# Altium schematic sheet I2C.SchDoc
size A4
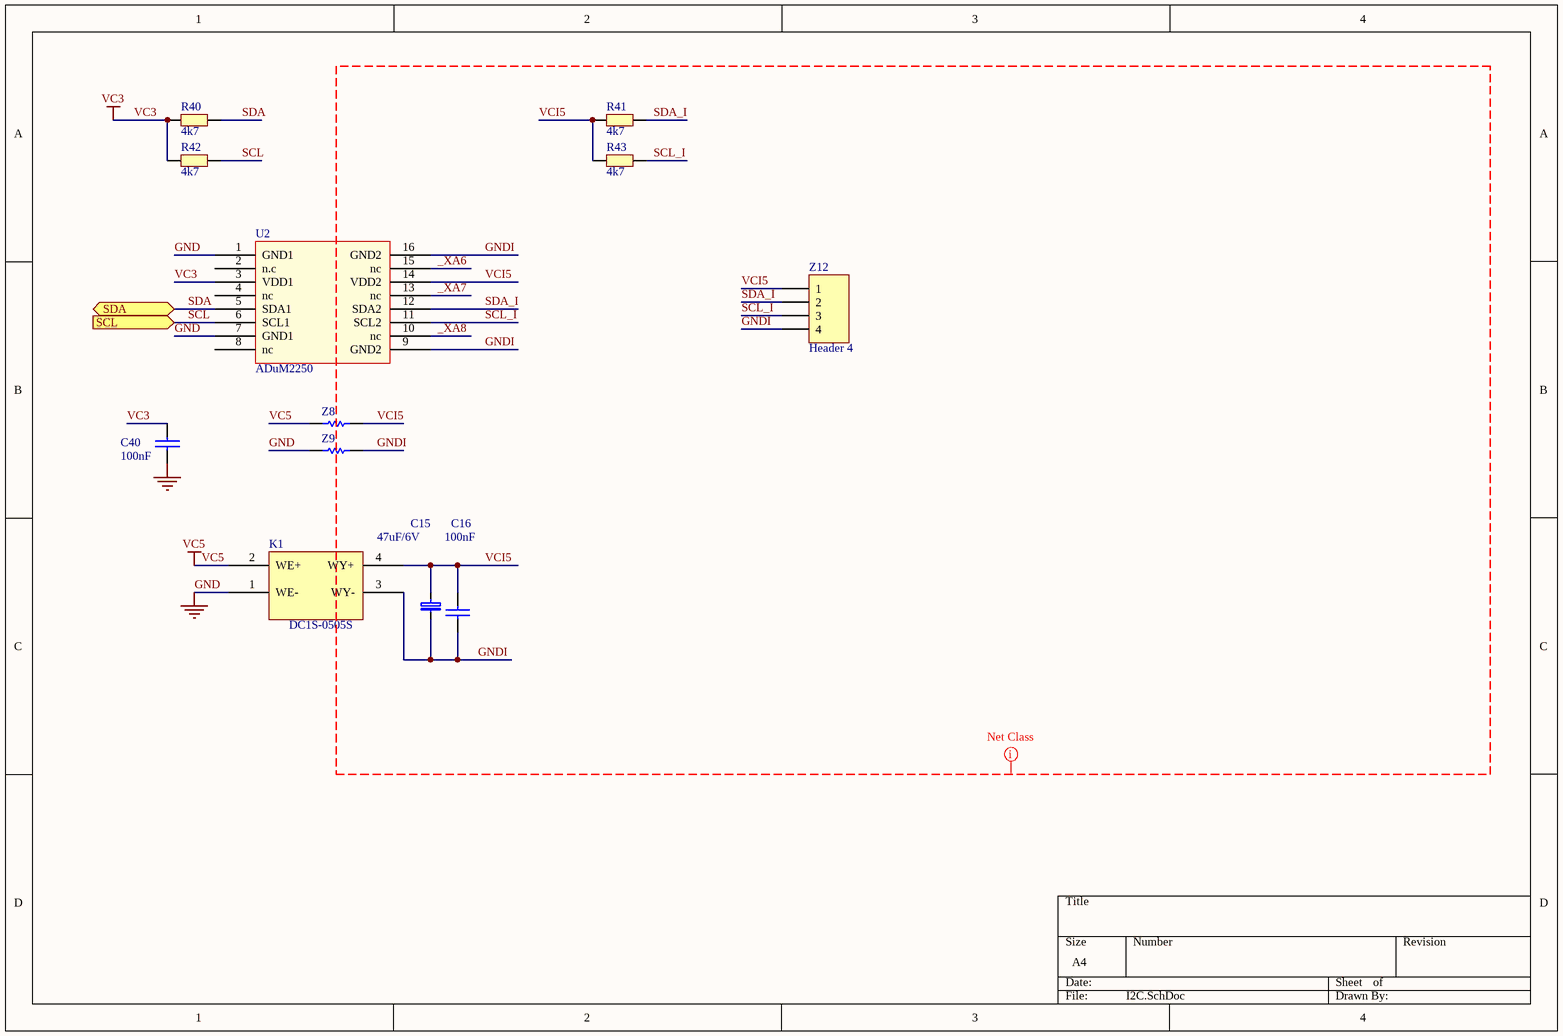
[diagram p0: I2C.SchDoc]

## Parts
C15  47uF/6V  [CAP_C]
C16  100nF  [0805C]
C40  100nF  [0805C]
K1  DC1S-0505S  [DCDC_SIL4]
R40  4k7  [0805R]
R41  4k7  [0805R]
R42  4k7  [0805R]
R43  4k7  [0805R]
U2  ADuM2250  [SMD16B]
Z8  0R  [1206R]  (value not drawn)
Z9  0R  [1206R]  (value not drawn)
Z12  Header 4  [ARC-L-4-3.5]

## Ports
SCL (in), SDA (bidir)

## Nets
GND: C40.1 K1.1(WE-) U2.1(GND1) U2.7(GND1) Z9.1
VC3: C40.2 R40.1 R42.1 U2.3(VDD1)
VC5: K1.2(WE+) Z8.1
_XA6: U2.15(nc)
_XA7: U2.13(nc)
_XA8: U2.10(nc)
GNDI: C15.1 C16.1 K1.3(WY-) U2.9(GND2) U2.16(GND2) Z9.2 Z12.4
SCL: R42.2 U2.6(SCL1) ; port SCL
SCL_I: R43.2 U2.11(SCL2) Z12.3
SDA: R40.2 U2.5(SDA1) ; port SDA
SDA_I: R41.2 U2.12(SDA2) Z12.2
VCI5: C15.2 C16.2 K1.4(WY+) R41.1 R43.1 U2.14(VDD2) Z8.2 Z12.1

Not connected (* = marked no-connect by the designer): U2 2(n.c) 4(nc) 8(nc)

## Layout directives
net class Class_4-20: _XA6, _XA7, _XA8, GNDI, SCL_I, SDA_I, VCI5

## Library data of the parts
C15 = CAP_TANTAL_SMD: KONDENSATOR ELEKTROLITYCZNY TANTALOWY SMD
C16 C40 = ProE70.tmp_100n_4
K1 = DCDC_AM1S
R40-R43 = RES3
Z8 Z9 = Res Semi: Semiconductor Resistor; Value: 1K; Published: 8-Jun-2000; LatestRevisionDate: 17-Jul-2002; LatestRevisionNote: Re-released for DXP Platform.; PackageReference: AXIAL-0.5; Publisher: Altium Limited; PackageDescription: Axial Device, Thru-Hole; 2 Leads; 0.5 in Pin Spacing
Z12 = Header 4: Header, 4-Pin; LatestRevisionDate: 17-Jul-2002; LatestRevisionNote: Re-released for DXP Platform.; Publisher: Altium Limited